# EAGLE design gecko (EAGLE 5.10)

## Sheet 1 of 3
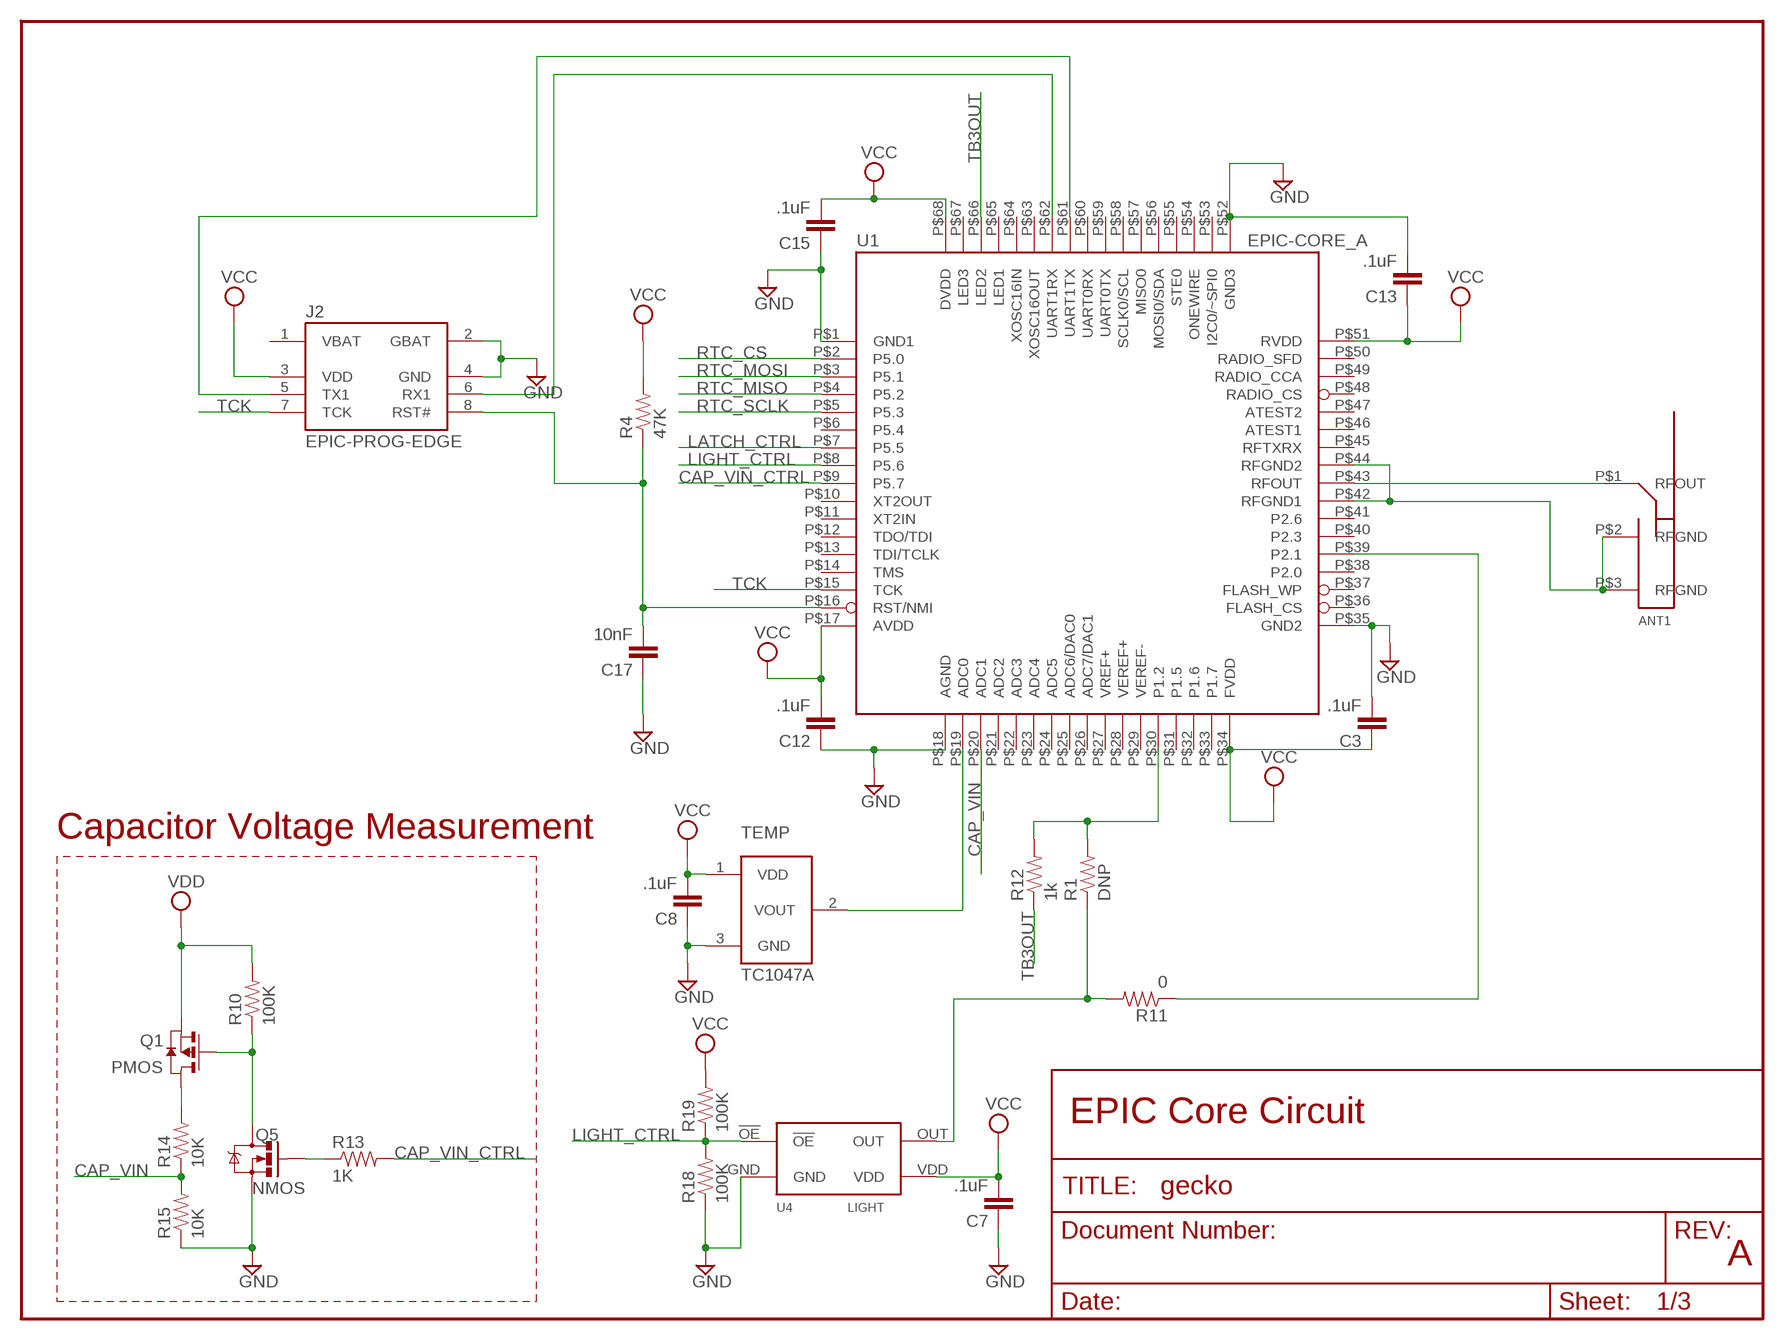
[diagram p0: schematic, sheet 1]

### Parts
ANT1  PIFA-2.4GHZ  [PIFA-2.4GHZ]
C3  .1uF  CAP0603-CAP  [0603-CAP]
C7  .1uF  CAP0603-CAP  [0603-CAP]
C8  .1uF  CAP0603-CAP  [0603-CAP]
C12  .1uF  CAP0603-CAP  [0603-CAP]
C13  .1uF  CAP0603-CAP  [0603-CAP]
C15  .1uF  CAP0603-CAP  [0603-CAP]
C17  10nF  CAP0603-CAP  [0603-CAP]
J2  EPIC-PROG-EDGE  [EPIC-PROG-EDGE]
Q1  PMOS  PMOSSOT23  [SOT-23]
Q5  NMOS  MOSFET-NCHANNELSMD  [SOT23-3]
R1  DNP  RESISTOR0603-RES  [0603-RES]
R4  47K  RESISTOR0603-RES  [0603-RES]
R10  100K  RESISTOR0603-RES  [0603-RES]
R11  0  RESISTOR0603-RES  [0603-RES]
R12  1k  RESISTOR0603-RES  [0603-RES]
R13  1K  RESISTOR0603-RES  [0603-RES]
R14  10K  RESISTOR0603-RES  [0603-RES]
R15  10K  RESISTOR0603-RES  [0603-RES]
R18  100K  RESISTOR0603-RES  [0603-RES]
R19  100K  RESISTOR0603-RES  [0603-RES]
TEMP  TC1047A  [SOT-23-3]
U1  EPIC-CORE_A  [EPIC-LCC68]
U4  LIGHT  TSL237T  [T_4LEAD]

### Nets
CAP_VIN: R14.1 R15.2 U1.P$20(ADC1)
CAP_VIN_CTRL: R13.2 U1.P$9(P5.7)
GND: C3.2 C7.1 C8.1 C12.1 C13.2 C15.1 C17.1 J2.2(GBAT) J2.4(GND) Q5.2(S) R15.1 R18.1 TEMP.3(GND) U1.P$1(GND1) U1.P$18(AGND) U1.P$35(GND2) U1.P$52(GND3) U4.GND ; also sheet 2,3
LATCH_CTRL: U1.P$7(P5.5) ; also sheet 2
LIGHT_CTRL: R18.2 R19.1 U1.P$8(P5.6) U4.!OE
LIGHT_FREQ_IN: R1.1 R11.2 U4.OUT
N$1: ANT1.P$1(RFOUT) U1.P$43(RFOUT)
N$6: Q1.3(G) Q5.3(D) R10.1
N$7: J2.6(RX1) U1.P$62(UART1RX)
N$8: R1.2 R12.2 U1.P$30(P1.2)
N$10: R11.1 U1.P$39(P2.1)
N$11: J2.5(TX1) U1.P$61(UART1TX)
N$12: Q5.1(G) R13.1
N$16: Q1.1(D) R14.2
N$17: C17.2 J2.8(RST#) R4.1 U1.P$16(RST/NMI)
N$20: TEMP.2(VOUT) U1.P$19(ADC0)
RFGND: ANT1.P$2(RFGND) ANT1.P$3(RFGND) U1.P$42(RFGND1) U1.P$44(RFGND2)
RTC_CS: U1.P$2(P5.0) ; also sheet 3
RTC_MISO: U1.P$4(P5.2) ; also sheet 3
RTC_MOSI: U1.P$3(P5.1) ; also sheet 3
RTC_SCLK: U1.P$5(P5.3) ; also sheet 3
TB3OUT: R12.1 U1.P$66(LED2)
TCK: J2.7(TCK) U1.P$15(TCK)
VCC: C3.1 C7.2 C8.2 C12.2 C13.1 C15.2 J2.3(VDD) R4.2 R19.2 TEMP.1(VDD) U1.P$17(AVDD) U1.P$34(FVDD) U1.P$51(RVDD) U1.P$68(DVDD) U4.VDD ; also sheet 2,3
VDD: Q1.2(S) R10.2 ; also sheet 2
Unconnected: J2.1(VBAT) U1.P$6(P5.4) U1.P$10(XT2OUT) U1.P$11(XT2IN) U1.P$12(TDO/TDI) U1.P$13(TDI/TCLK) U1.P$14(TMS) U1.P$21(ADC2) U1.P$22(ADC3) U1.P$23(ADC4) U1.P$24(ADC5) U1.P$25(ADC6/DAC0) U1.P$26(ADC7/DAC1) U1.P$27(VREF+) U1.P$28(VEREF+) U1.P$29(VEREF-) U1.P$31(P1.5) U1.P$32(P1.6) U1.P$33(P1.7) U1.P$36(FLASH_CS) U1.P$37(FLASH_WP) U1.P$38(P2.0) U1.P$40(P2.3) U1.P$41(P2.6) U1.P$45(RFTXRX) U1.P$46(ATEST1) U1.P$47(ATEST2) U1.P$48(RADIO_CS) U1.P$49(RADIO_CCA) U1.P$50(RADIO_SFD) U1.P$53(I2C0/~SPI0) U1.P$54(ONEWIRE) U1.P$55(STE0) U1.P$56(MOSI0/SDA) U1.P$57(MISO0) U1.P$58(SCLK0/SCL) U1.P$59(UART0TX) U1.P$60(UART0RX) U1.P$63(XOSC16OUT) U1.P$64(XOSC16IN) U1.P$65(LED1) U1.P$67(LED3)

### Notes on the sheet
- Capacitor Voltage Measurement
- EPIC Core Circuit
- A

## Sheet 2 of 3
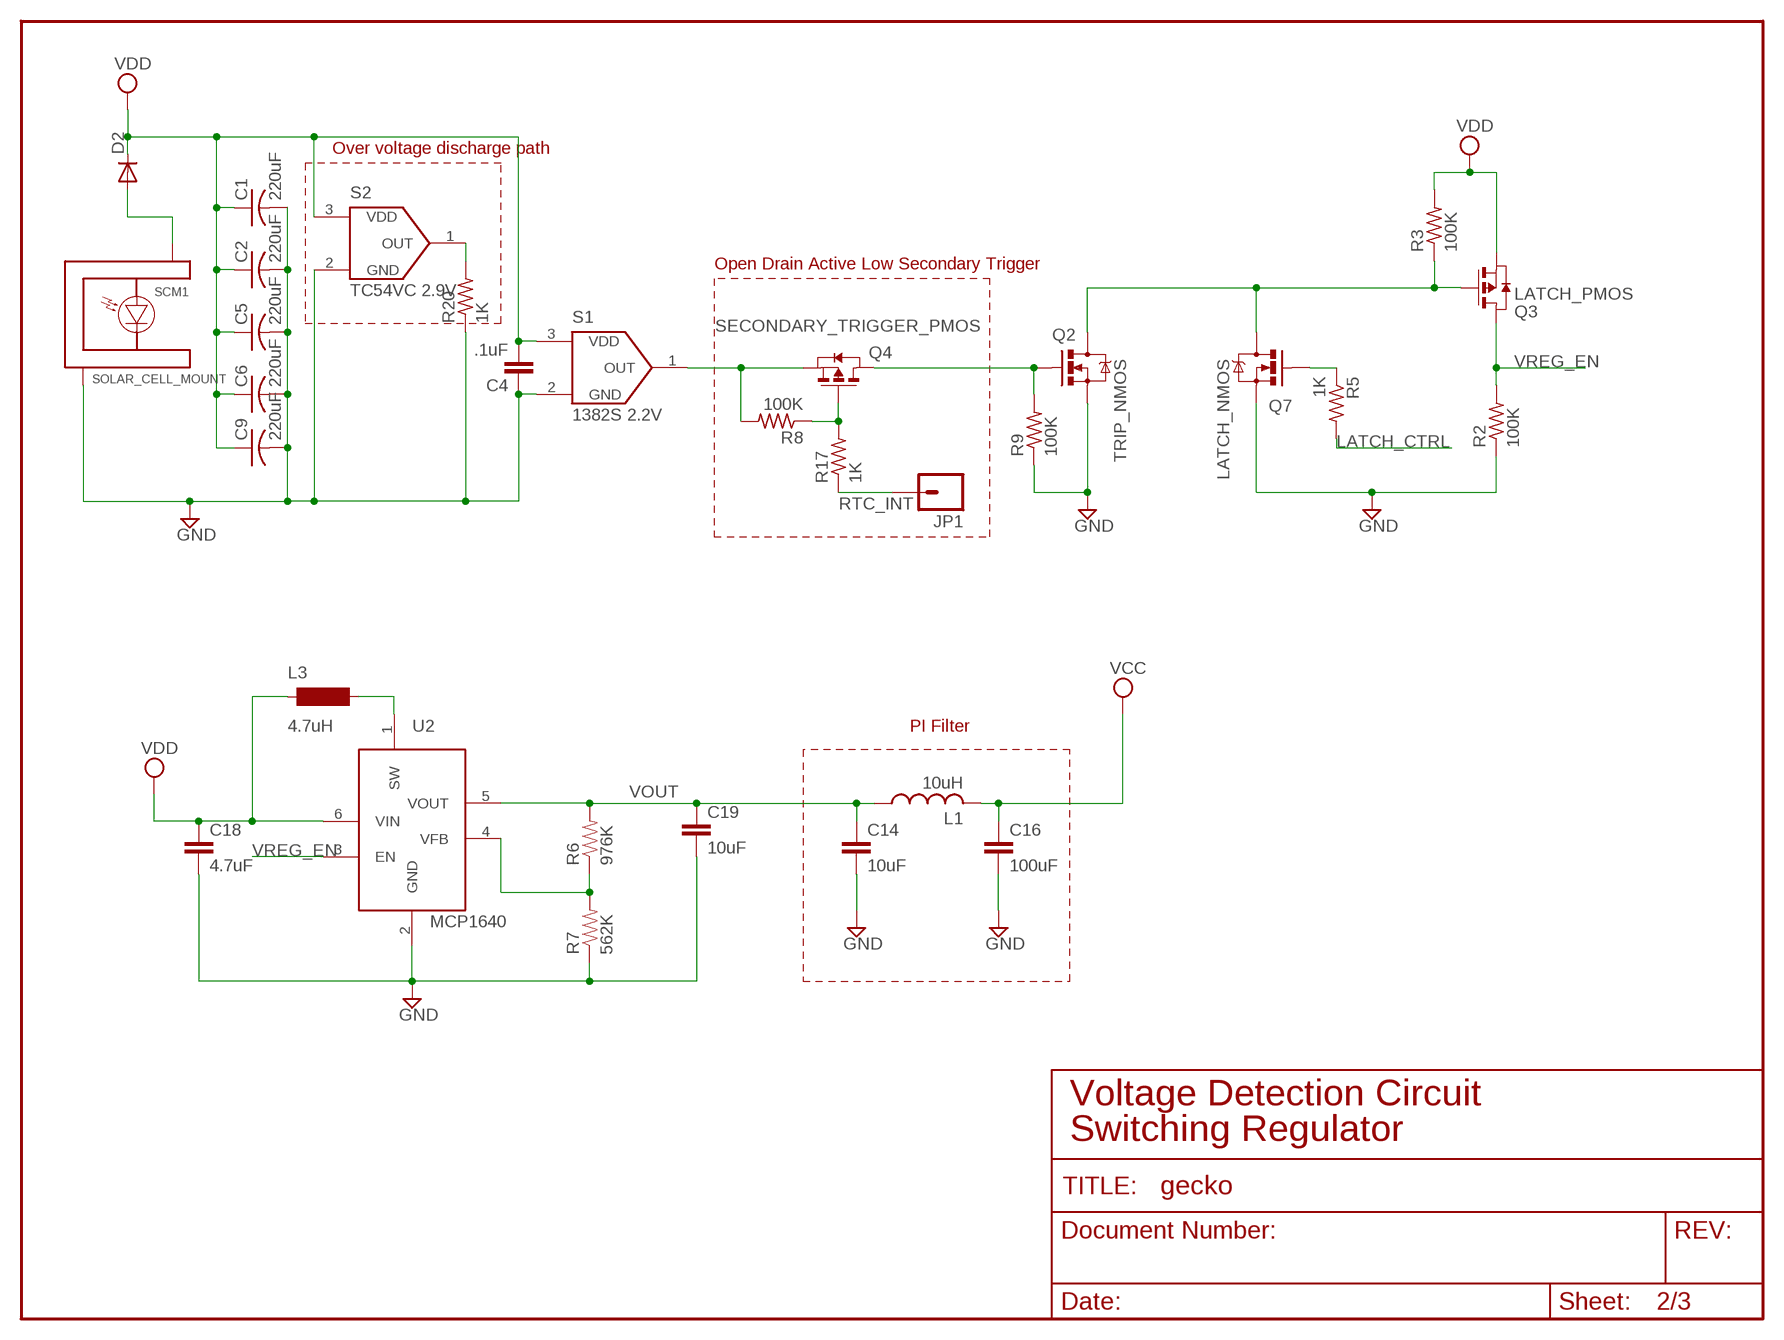
[diagram p1: schematic, sheet 2]

### Parts
C1  220uF  C-USC1206  [C1206]
C2  220uF  C-USC1206  [C1206]
C4  .1uF  CAP0603-CAP  [0603-CAP]
C5  220uF  C-USC1206  [C1206]
C6  220uF  C-USC1206  [C1206]
C9  220uF  C-USC1206  [C1206]
C14  10uF  CAP0805  [0805]
C16  100uF  CAP0805  [0805]
C18  4.7uF  CAP0603-CAP  [0603-CAP]
C19  10uF  CAP0805  [0805]
D2  DIODESOD  [SOD-323]
JP1  M01SMDNS  [1X01NS]
L1  10uH  L-USL2012C  [L2012C]
L3  4.7uH  INDUCTOR  [INDUCTOR]
Q2  TRIP_NMOS  MOSFET-NCHANNELSMD  [SOT23-3]
Q3  LATCH_PMOS  PMOSSOT23  [SOT-23]
Q4  SECONDARY_TRIGGER_PMOS  PMOSSOT23  [SOT-23]
Q7  LATCH_NMOS  MOSFET-NCHANNELSMD  [SOT23-3]
R2  100K  R-US_R0603  [R0603]
R3  100K  R-US_R0603  [R0603]
R5  1K  R-US_R0603  [R0603]
R6  976K  RESISTOR0603-RES  [0603-RES]
R7  562K  RESISTOR0603-RES  [0603-RES]
R8  100K  R-US_R0603  [R0603]
R9  100K  R-US_R0603  [R0603]
R17  1K  R-US_R0603  [R0603]
R20  1K  R-US_R0603  [R0603]
S1  1382S 2.2V  1382  [SOT-23-3]
S2  TC54VC 2.9V  1382  [SOT-23-3]
SCM1  SOLAR_CELL_MOUNT  [SOLAR_CELL_MOUNT]
U2  MCP1640  [SOT-23-6]

### Nets
GND: C1.2 C2.2 C4.1 C5.2 C6.2 C9.2 C14.2 C16.2 C18.2 C19.2 Q2.2(S) Q7.2(S) R2.1 R7.1 R9.1 R20.1 S1.2(GND) S2.2(GND) SCM1.NEG U2.2(GND) ; also sheet 1,3
LATCH_CTRL: R5.2 ; also sheet 1
N$2: Q2.1(G) Q4.1(D) R9.2
N$3: L3.2 U2.1(SW)
N$4: Q4.2(S) R8.2 S1.1(OUT)
N$5: R6.1 R7.2 U2.4(VFB)
N$9: Q2.3(D) Q3.3(G) Q7.3(D) R3.1
N$14: D2.2(A) SCM1.POS
N$15: Q7.1(G) R5.1
N$18: Q4.3(G) R8.1 R17.2
N$19: R20.2 S2.1(OUT)
RTC_INT: JP1.1 R17.1 ; also sheet 3
VCC: C16.1 L1.2 ; also sheet 1,3
VDD: C1.1 C2.1 C4.2 C5.1 C6.1 C9.1 C18.1 D2.1(C) L3.1 Q3.2(S) R3.2 S1.3(VDD) S2.3(VDD) U2.6(VIN) ; also sheet 1
VOUT: C14.1 C19.1 L1.1 R6.2 U2.5(VOUT)
VREG_EN: Q3.1(D) R2.2 U2.3(EN)

### Notes on the sheet
- Over voltage discharge path
- Open Drain Active Low Secondary Trigger
- PI Filter
- Voltage Detection Circuit
- Switching Regulator

## Sheet 3 of 3
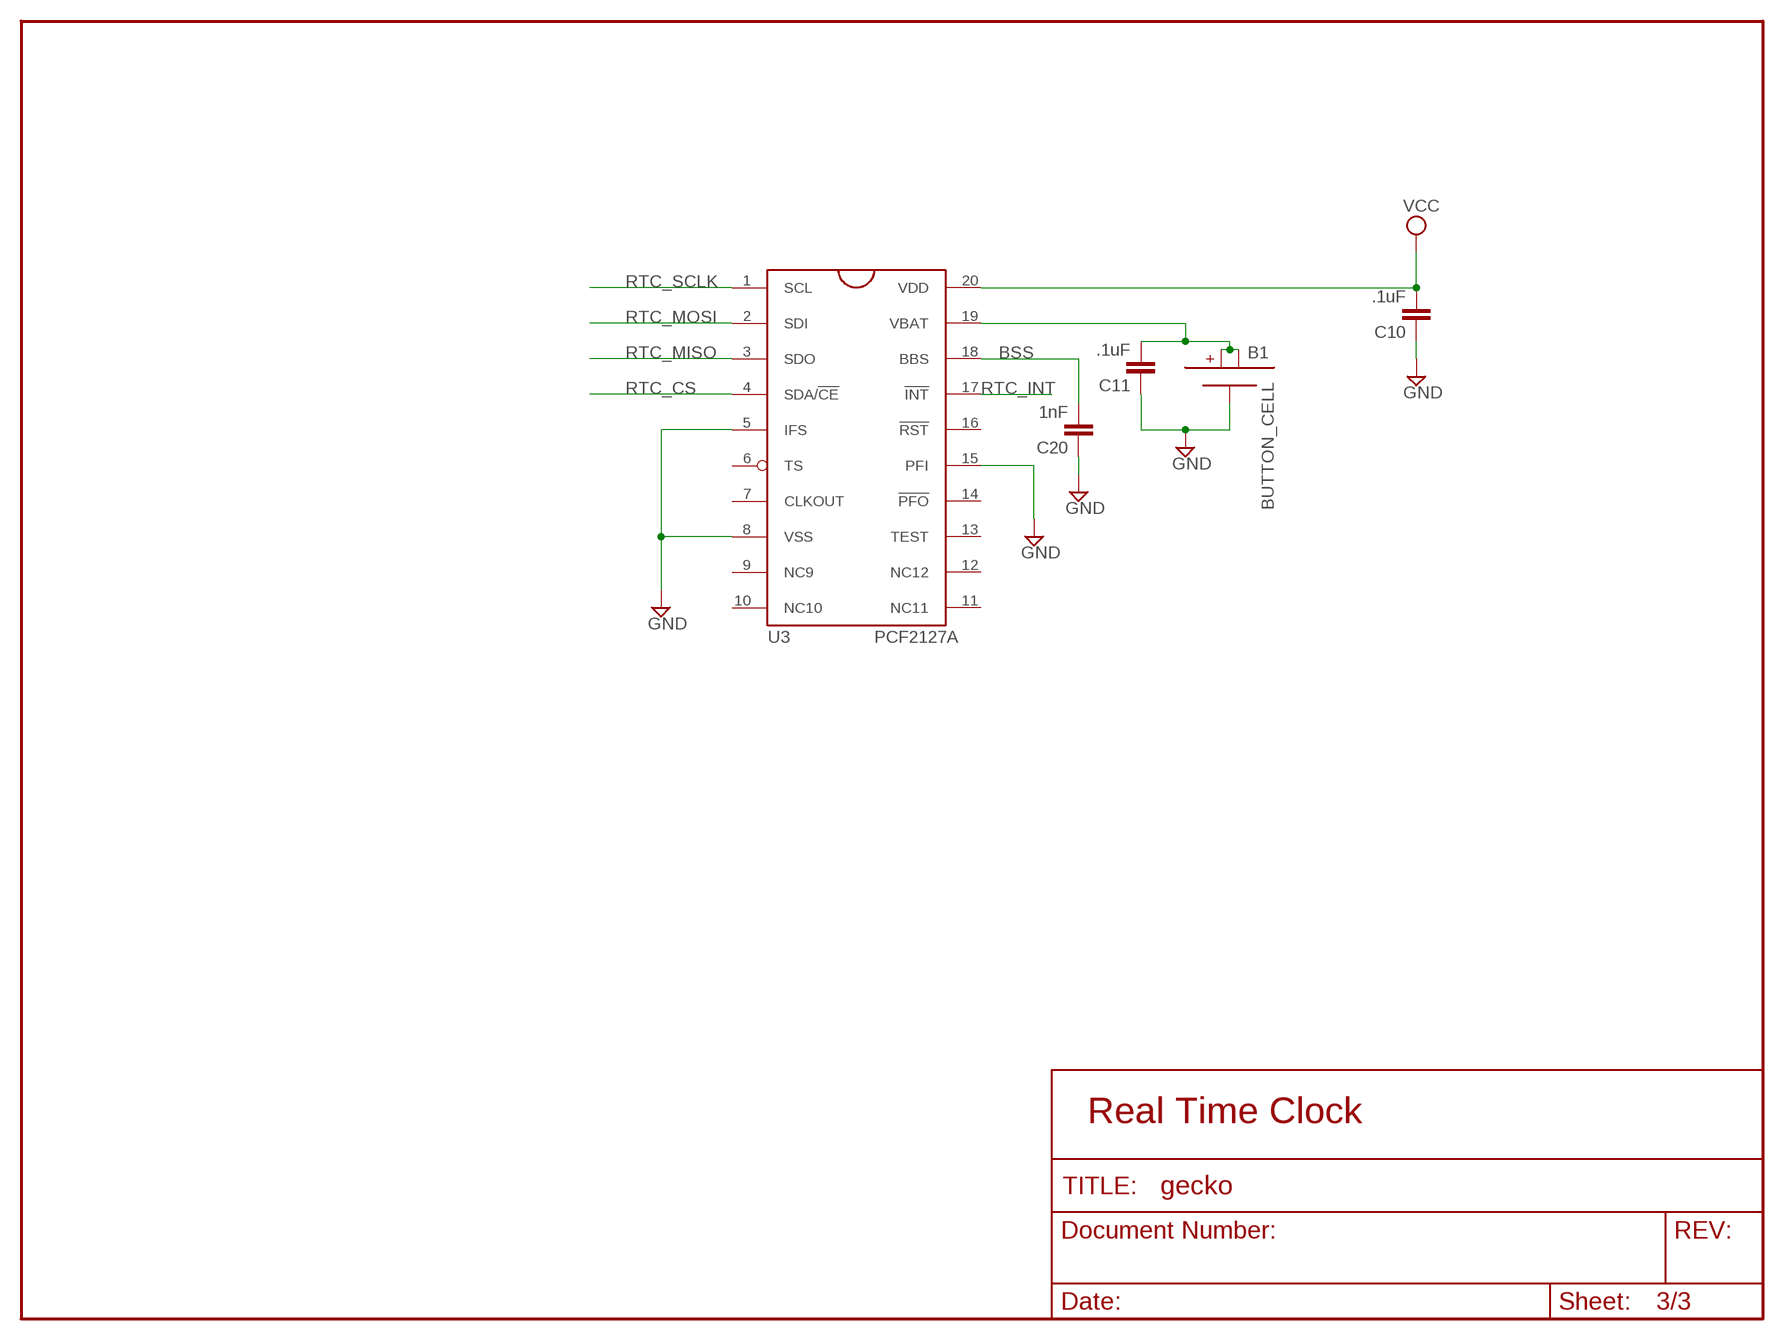
[diagram p2: schematic, sheet 3]

### Parts
B1  BUTTON_CELL  [RETAINER_3000]
C10  .1uF  CAP0603-CAP  [0603-CAP]
C11  .1uF  CAP0603-CAP  [0603-CAP]
C20  1nF  CAP0603-CAP  [0603-CAP]
U3  PCF2127A  [SO-20]

### Nets
BSS: C20.2 U3.18(BBS)
GND: B1.NEG C10.1 C11.1 C20.1 U3.5(IFS) U3.8(VSS) U3.15(PFI) ; also sheet 1,2
N$13: B1.POS1 B1.POS2 C11.2 U3.19(VBAT)
RTC_CS: U3.4(SDA/!CE) ; also sheet 1
RTC_INT: U3.17(!INT) ; also sheet 2
RTC_MISO: U3.3(SDO) ; also sheet 1
RTC_MOSI: U3.2(SDI) ; also sheet 1
RTC_SCLK: U3.1(SCL) ; also sheet 1
VCC: C10.2 U3.20(VDD) ; also sheet 1,2
Unconnected: U3.6(TS) U3.7(CLKOUT) U3.9(NC9) U3.10(NC10) U3.11(NC11) U3.12(NC12) U3.13(TEST) U3.14(!PFO) U3.16(!RST)

### Notes on the sheet
- Real Time Clock

## Library data of the parts
ANT1 = berkeley-epic:PIFA-2.4GHZ
B1 = mylibrary:BUTTON_CELL
C1 C2 C5 C6 C9 = rcl:C-US: CAPACITOR, American symbol
C3 C4 C7 C8 C10-C20 = SparkFun:CAP: Capacitor Standard 0603 ceramic capacitor, and 0.1" leaded capacitor.
D2 = SparkFun:DIODE: Diode These are standard reverse protection diodes and small signal diodes. SMA package can handle up to about 1A. SOD-323 can handle about 200mA. What the SOD-323 package when ordering, there are some mfgs out there that are 5-pin packages.
J2 = berkeley-epic:EPIC-PROG-EDGE
JP1 = SparkFun:M01: Header 1 Standard 1-pin 0.1" header. Use with straight break away headers (SKU : PRT-00116), right angle break away headers (PRT-00553), swiss pins (PRT-00743), machine pins (PRT-00117), and female headers (PRT-00115).
L1 = rcl:L-US: INDUCTOR, American symbol
L3 = mylibrary:INDUCTOR
Q1 Q3 Q4 = berkeley-epic:PMOSSOT23: MOS FET
Q2 Q5 Q7 = SparkFun:MOSFET-NCHANNEL
R1 R4 R6 R7 R10-R15 R18 R19 = SparkFun:RESISTOR: Resistor Basic schematic elements and footprints for 0603, 1206, and PTH 1/10th watt (small) resistors.
R2 R3 R5 R8 R9 R17 R20 = rcl:R-US_: RESISTOR, American symbol
S1 S2 = mylibrary:1382
SCM1 = mylibrary:SOLAR_CELL_MOUNT
TEMP = mylibrary:TC1047A
U1 = berkeley-epic:EPIC-CORE_A
U2 = mylibrary:MCP1640
U3 = mylibrary:PCF2127A
U4 = mylibrary:TSL237T

## Board
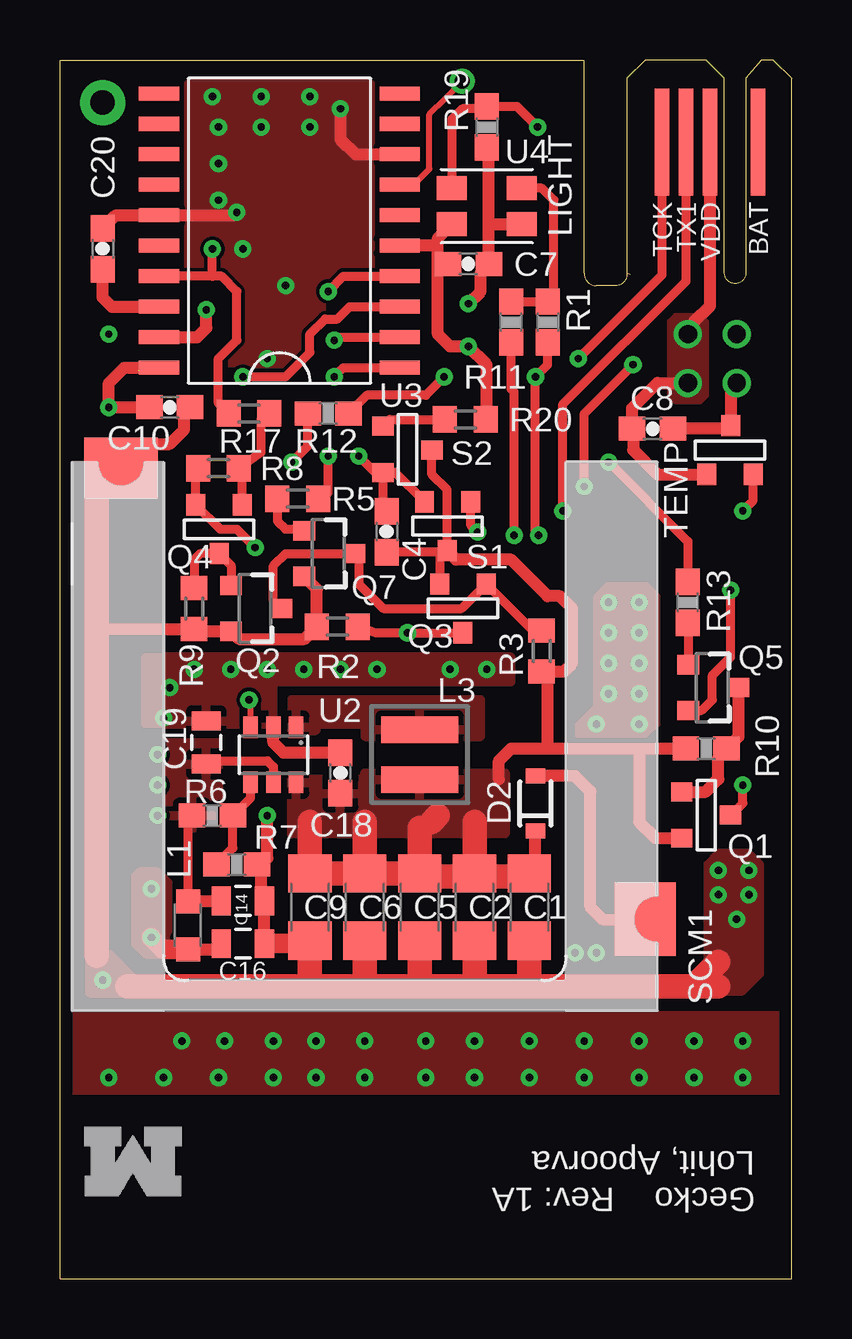
[diagram p3: board, top side]
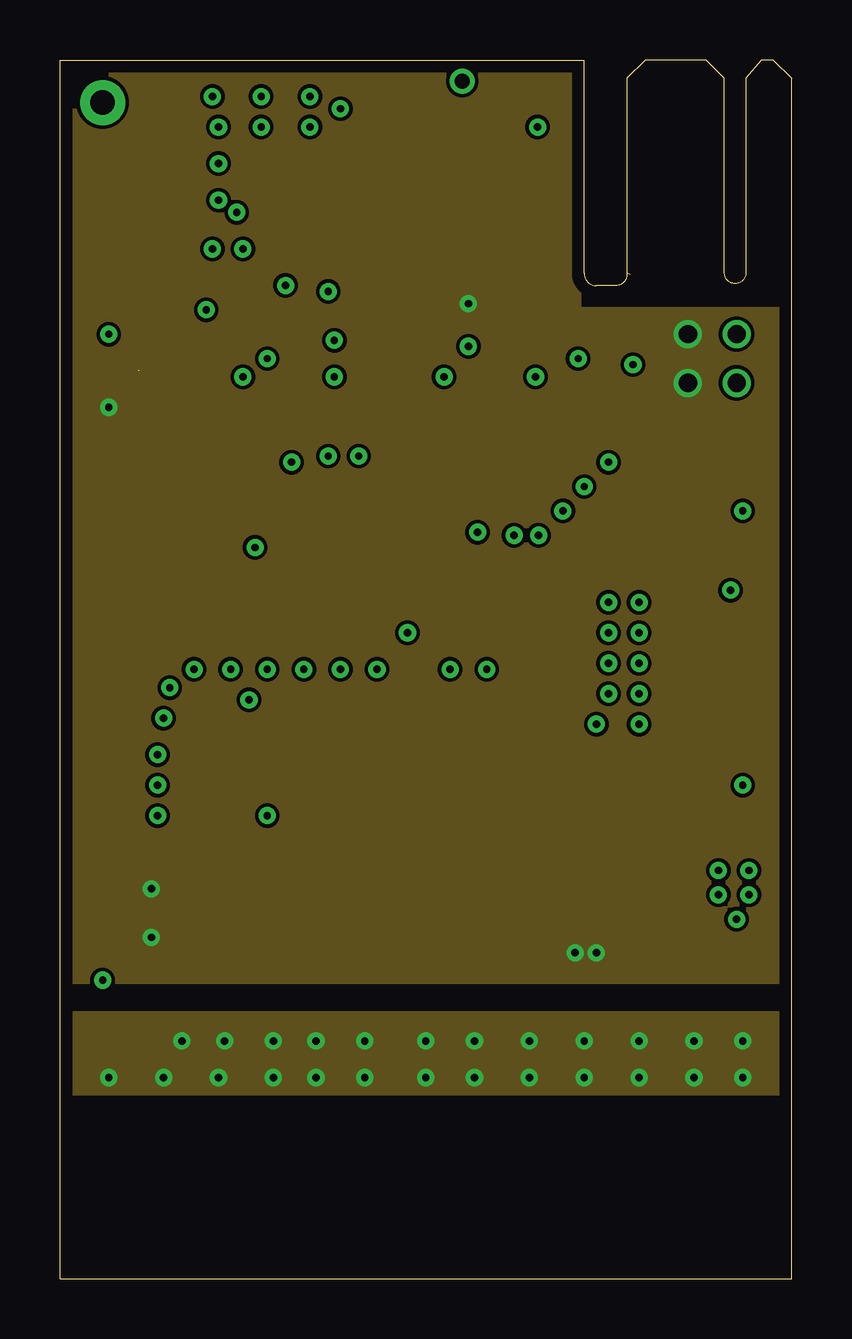
[diagram p4: board, inner layer Power]
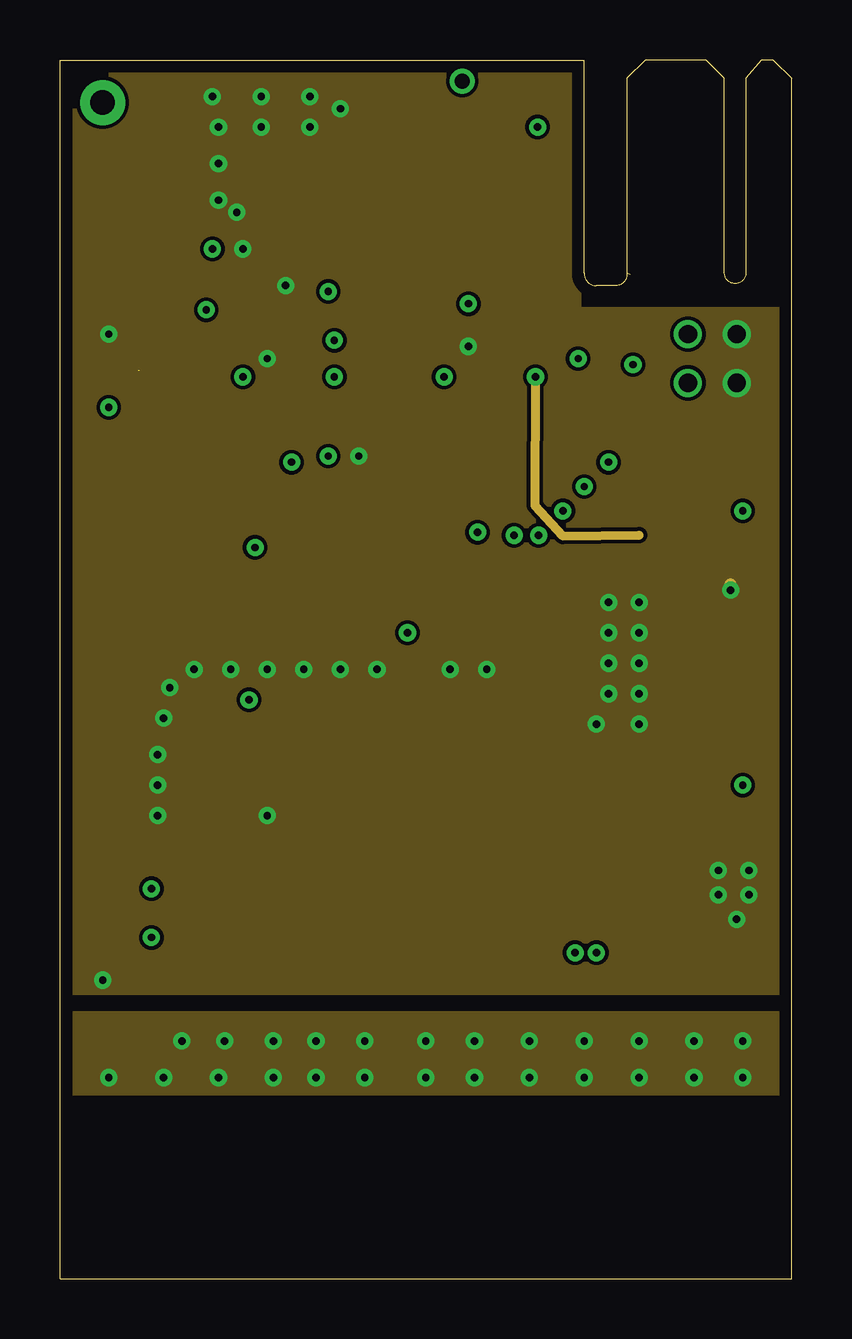
[diagram p5: board, inner layer Ground]
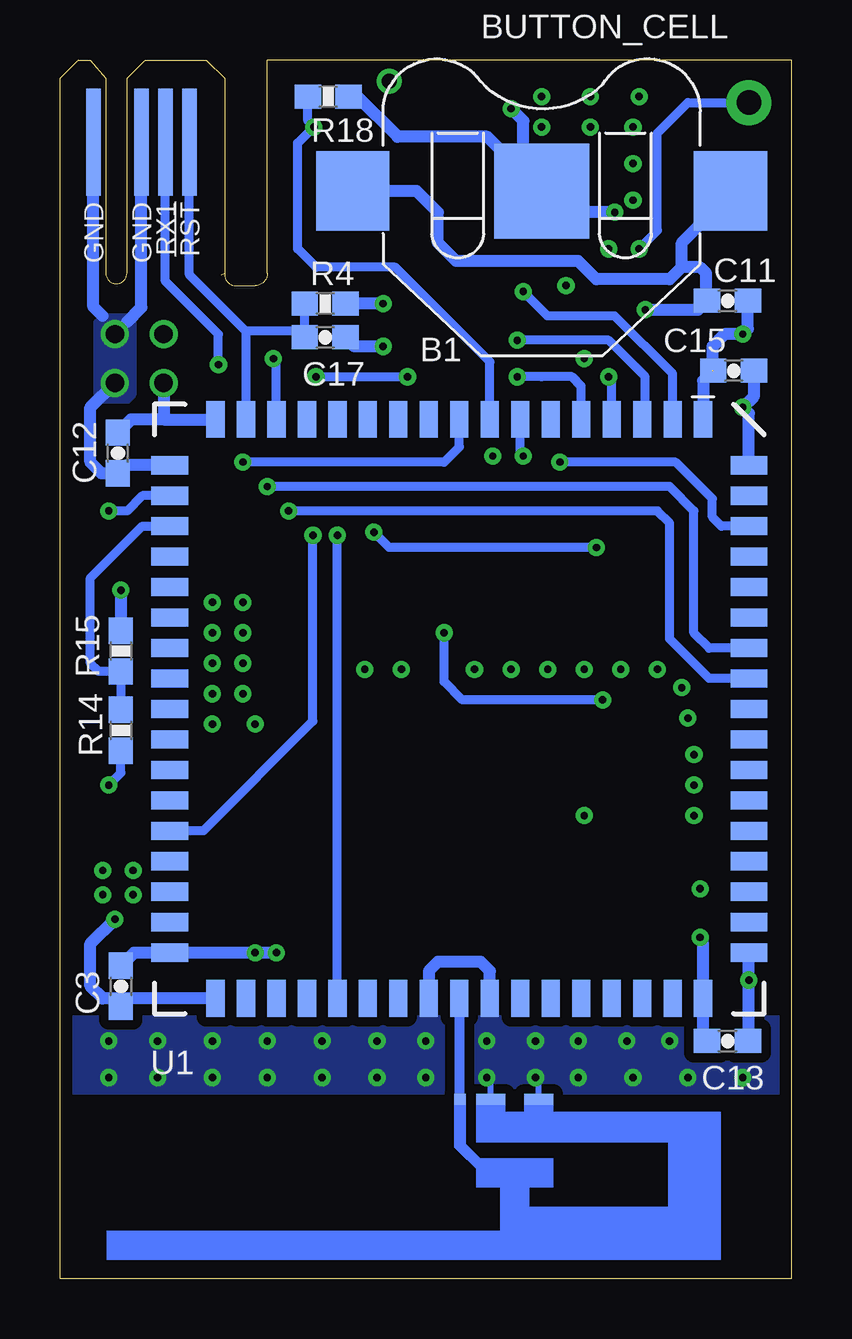
[diagram p6: board, bottom side, seen from below]

Size 30.48 x 50.8 mm. Coordinates in mm from the lower left corner, seen from the top.
Outline: 23.62,41.91 23.62,50.04 24.38,50.8 26.92,50.8 27.69,50.04 27.69,41.91 arc177 28.57,41.91 28.57,50.04 29.21,50.8 29.72,50.8 30.48,50.04 30.48,0 0,0 0,50.8 21.84,50.8 21.84,41.91 arc93 22.35,41.39 23.18,41.39 arc90 23.62,41.91
Outline: 23.76,41.85 23.62,41.91
Copper layers (1+2*15+16): Top 0.0178mm / dielectric 0.3048mm / Power 0.0356mm / dielectric 0.7112mm / Ground 0.0356mm / dielectric 0.3048mm / Bottom 0.0178mm
Design rules "SSC-EAGLE-4Lyr_v1.0.0.3 *": minimum track width 6mil, minimum drill 8mil, track to track 6mil, track to pad 6mil, pad to pad 6mil, via to via 6mil, smd to smd 6mil, copper to edge 20mil, drill to drill 16mil, minimum pad ring 8mil, minimum via ring 8mil, stop-mask expansion 3mil, vias tented up to drill 12mil, thermal gap 10mil

### Footprints (pad centres in the part's own frame; a part is rotated, then mirrored left to right if it is on the bottom)
PIFA-2.4GHZ = smd 0.46 x 0.46: P$1 -2.65,-1.495 | smd 0.46 x 1.2: P$2 -2.655,1.785; P$3 -2.65,-0.215
RETAINER_3000 = smd 3.962 x 3.962: NEG 0,0 | smd 3.048 x 3.302: POS1 -7.874,0; POS2 7.874,0
C1206 = smd 1.6 x 1.8: 1 -1.4,0; 2 1.4,0
0603-CAP = smd 1.1 x 1: 1 -0.85,0; 2 0.85,0
0805 = smd 0.8 x 1.2: 1 -0.9,0; 2 0.9,0
SOD-323 = smd 0.63 x 0.83: 1 -1.15,0; 2 1.15,0
EPIC-PROG-EDGE = smd 0.61 x 4.445: 1 -1.001,3.619; 3 1.001,3.619; 5 2.002,3.619; 7 3.002,3.619 | smd 0.61 x 4.445 bottom: 2 -1.001,3.619; 4 1.001,3.619; 6 2.002,3.619; 8 3.002,3.619
1X01NS = drill 1.016 pad 1.88 round: 1 0,0
L2012C = smd 1 x 1: 1 -1,0; 2 1,0
INDUCTOR = smd 1.118 x 3.2: 1 -1.041,0; 2 1.041,0
SOT-23 = smd 0.787 x 0.889: 1 0.025,-1.016; 2 -0.94,1.016; 3 0.991,1.016
SOT23-3 = smd 0.8 x 0.9: 1 -0.95,-1; 2 0.95,-1; 3 0,1.1
0603-RES = smd 1.1 x 1: 1 -0.85,0; 2 0.85,0
R0603 = smd 1 x 1.1: 1 -0.85,0; 2 0.85,0
SOT-23-3 = smd 0.787 x 0.889: 1 -0.991,-1.016; 2 0.94,-1.016; 3 0,1.016
SOLAR_CELL_MOUNT = smd 2.54 x 3.048: NEG 22.606,22.352 | smd 3.048 x 2.54: POS 3.81,0.508
EPIC-LCC68 = smd 1.524 x 0.762: P$1 -12.065,10.16; P$2 -12.065,8.89; P$3 -12.065,7.62; P$4 -12.065,6.35; P$5 -12.065,5.08; P$6 -12.065,3.81; P$7 -12.065,2.54; P$8 -12.065,1.27; P$9 -12.065,0; P$10 -12.065,-1.27; P$11 -12.065,-2.54; P$12 -12.065,-3.81; P$13 -12.065,-5.08; P$14 -12.065,-6.35; P$15 -12.065,-7.62; P$16 -12.065,-8.89; P$17 -12.065,-10.16; P$35 12.065,-10.16; P$36 12.065,-8.89; P$37 12.065,-7.62; P$38 12.065,-6.35; P$39 12.065,-5.08; P$40 12.065,-3.81; P$41 12.065,-2.54; P$42 12.065,-1.27; P$43 12.065,0; P$44 12.065,1.27; P$45 12.065,2.54; P$46 12.065,3.81; P$47 12.065,5.08; P$48 12.065,6.35; P$49 12.065,7.62; P$50 12.065,8.89; P$51 12.065,10.16 | smd 0.762 x 1.524: P$18 -10.16,-12.065; P$19 -8.89,-12.065; P$20 -7.62,-12.065; P$21 -6.35,-12.065; P$22 -5.08,-12.065; P$23 -3.81,-12.065; P$24 -2.54,-12.065; P$25 -1.27,-12.065; P$26 0,-12.065; P$27 1.27,-12.065; P$28 2.54,-12.065; P$29 3.81,-12.065; P$30 5.08,-12.065; P$31 6.35,-12.065; P$32 7.62,-12.065; P$33 8.89,-12.065; P$34 10.16,-12.065; P$52 10.16,12.065; P$53 8.89,12.065; P$54 7.62,12.065; P$55 6.35,12.065; P$56 5.08,12.065; P$57 3.81,12.065; P$58 2.54,12.065; P$59 1.27,12.065; P$60 0,12.065; P$61 -1.27,12.065; P$62 -2.54,12.065; P$63 -3.81,12.065; P$64 -5.08,12.065; P$65 -6.35,12.065; P$66 -7.62,12.065; P$67 -8.89,12.065; P$68 -10.16,12.065
SOT-23-6 = smd 0.6 x 0.9: 1 -0.95,-1.15; 2 0,-1.15; 3 0.95,-1.15; 4 0.95,1.15; 5 0,1.15; 6 -0.95,1.15
SO-20 = smd 1.676 x 0.584: 1 -5.016,5.715; 2 -5.016,4.445; 3 -5.016,3.175; 4 -5.016,1.905; 5 -5.016,0.635; 6 -5.016,-0.635; 7 -5.016,-1.905; 8 -5.016,-3.175; 9 -5.016,-4.445; 10 -5.016,-5.715; 11 5.016,-5.715; 12 5.016,-4.445; 13 5.016,-3.175; 14 5.016,-1.905; 15 5.016,-0.635; 16 5.016,0.635; 17 5.017,1.905; 18 5.016,3.175; 19 5.016,4.445; 20 5.016,5.715
T_4LEAD = smd 1.25 x 1: !OE -1.45,0.75; GND -1.45,-0.75; OUT 1.45,0.75; VDD 1.45,-0.75

### Placement (x,y rotation side)
ANT1  12.32,4.83 270 bottom
B1  10.41,45.34 0 bottom
C1  19.56,15.49 270 top
C2  17.27,15.49 270 top
C3  27.94,12.19 270 bottom
C4  13.61,31.14 270 top
C5  14.99,15.49 270 top
C6  12.7,15.49 270 top
C7  17.02,42.29 0 top
C8  24.69,35.43 180 top
C9  10.41,15.49 270 top
C10  4.57,36.32 180 top
C11  2.67,40.77 180 bottom
C12  28.07,34.42 90 bottom
C13  2.67,9.91 0 bottom
C14  7.62,15.75 0 top
C15  2.41,37.85 0 bottom
C16  7.62,13.97 0 top
C17  19.43,39.24 180 bottom
C18  11.68,21.08 90 top
C19  6.1,22.35 90 top
C20  1.78,42.93 270 top
D2  19.81,19.81 90 top
J2  28.09,51 180 top
JP1  1.78,49.02 0 top
L1  5.33,14.73 270 top
L3  14.99,21.84 90 top
Q1  26.92,19.3 90 top
Q2  8.13,27.94 270 top
Q3  16.76,27.94 0 top
Q4  6.6,31.24 0 top
Q5  27.18,24.64 270 top
Q7  11.18,30.23 270 top
R1  20.32,39.88 270 top
R2  11.56,27.18 0 top
R3  20.07,26.16 270 top
R4  19.43,40.64 0 bottom
R5  9.91,32.51 0 top
R6  6.35,19.3 180 top
R7  7.37,17.27 180 top
R8  6.6,33.78 180 top
R9  5.59,27.94 90 top
R10  26.92,22.1 180 top
R11  18.8,39.88 90 top
R12  11.18,36.07 0 top
R13  26.16,28.19 90 top
R14  27.94,22.86 270 bottom
R15  27.94,26.16 270 bottom
R17  7.87,36.07 0 top
R18  19.3,49.28 180 bottom
R19  17.78,48.01 270 top
R20  16.89,35.81 180 top
S1  16.13,31.37 180 top
S2  14.48,34.54 270 top
SCM1  24.89,11.18 90 top
TEMP  27.94,34.54 0 top
U1  13.84,23.75 270 bottom
U2  8.89,21.84 180 top
U3  9.14,43.69 180 top
U4  17.78,44.7 0 top
U$1  [BLOCK-M]  5.08,6.35 180 top

### Tracks (layer width: path | path; a pad name or v marks a point on that pad's centre or on a via)
BSS
  Top 0.508: U3.18 2.16,40.51 1.78,40.89 C20.2
CAP_VIN
  Bottom 0.381: R14.1 R15.2 28.87,25.31 29.21,25.65 29.21,29.21 27.05,31.37 U1.P$20
CAP_VIN_CTRL  (via drill 0.3)
  Top 0.381: R13.2 26.16,30.73 v22.86,34.04
  Bottom 0.381: v22.86,34.04 14.48,34.04 13.84,34.67 U1.P$9
GND  (via drill 0.3, 0.76)  (1 unrouted)
  Top 0.305: R20.1 17.78,36.16
  Top 0.381: C14.2 8.38,16.12 | 8.38,17.53 R7.1 | Q5.2 26.74,23.69 27.18,24.13 27.18,25.15 27.94,25.91 v27.94,28.7 | R2.1 11.03,26.99 | S2.2 13.97,33.6 S1.2 | S2.2 13.13,33.6 v12.45,34.29 | C4.1 13.46,31.99 S2.2
  Top 0.508: U2.2 8.89,22.35 9.31,21.93 C18.2 11.6,22.1 | 8.38,16.12 8.38,17.27 | 8.38,17.27 8.38,17.53 | C16.2 C14.2 | C8.1 27.81,35.43 TEMP.3 27.94,37.08 v28.19,37.34 | 17.78,35.81 17.78,36.16 17.78,38.1 v17.02,38.86 16.26,38.86 15.75,39.37 15.75,42.42 | 1.52,27.18 1.61,27.09 R9.1 5.69,26.99 Q2.2 7.45,26.67 10.2,26.67 R2.1 10.71,28.75 Q7.2 | 15.75,42.42 15.75,43.18 | 15.75,43.18 15.75,43.37 U4.GND | U3.5 15.62,43.05 15.75,43.18 | C7.1 15.88,42.29 15.75,42.42 | U3.8 12.32,46.86 11.68,47.5 v11.68,48.77 | v7.37,44.45 7.24,44.32 U3.15 2.33,44.32 C20.1 | v8.64,19.3 8.64,17.53 8.38,17.27 | C10.1 5.33,36.32 5.17,36.16 5.17,35.39 4.57,34.8 3.56,34.8 SCM1.NEG
  Top 0.813: C16.2 10.29,13.97 C9.2
  Top 1.016: SCM1.NEG 1.52,32.77 1.52,27.18 1.52,13.46 | 2.79,12.19 10.41,12.19 | 10.41,12.19 12.7,12.19 | 12.7,12.19 14.99,12.19 | 14.99,12.19 17.02,12.19 | 17.02,12.19 19.56,12.19 | 19.56,12.19 26.42,12.19 | 10.41,12.19 C9.2 | 12.7,12.19 C6.2 | 14.99,12.19 C5.2 | C2.2 17.27,12.45 17.02,12.19 | 19.56,12.19 C1.2 | 26.42,12.19 27.43,13.21 | 26.42,12.19 27.43,12.19
  Ground 0.508: v27.94,28.7 27.94,28.96
  Bottom 0.508: U1.P$52 v1.78,12.45 1.78,9.95 C13.2 | U1.P$35 27.6,11.68 | 27.6,11.68 C3.2 | 27.6,11.68 28.7,11.68 29.21,12.19 29.21,13.97 v28.19,14.99 | v27.94,28.7 R15.1 | J2.2 29.09,40.52 28.7,40.13 | J2.4 27.09,40.48 27.69,39.88 | U1.P$18 27.73,33.91 C12.1 28.74,33.57 29.21,34.04 29.21,36.32 v28.19,37.34 | U1.P$1 3.68,37.43 C15.1 | v17.02,38.86 18.2,38.86 C17.1 | B1.NEG 11.62,46.55 | v11.68,48.77 11.18,48.26 11.18,46.99 11.62,46.55 | v7.37,44.45 9.4,44.45 | C11.1 1.82,39.59 v2.03,39.37 2.79,39.37 3.3,38.86 3.3,37.85 | R18.1 18.09,49.28 16.41,47.6 12.68,47.6 11.62,46.55
  other vias: 27.43,17.02 4.57,24.64 28.19,39.37 22.86,24.38 17.78,25.4 28.7,17.02 27.43,16 28.7,16 16.26,25.4 13.21,25.4 11.68,25.4 10.16,25.4 8.64,25.4 7.11,25.4 5.59,25.4 4.32,23.37 4.06,21.84 4.06,20.57 4.06,19.3 22.35,23.11 24.13,23.11 24.13,24.38 24.13,25.65 24.13,26.92 24.13,28.19 22.86,28.19 22.86,26.92 22.86,25.65 6.35,49.28 8.38,49.28 10.41,49.28 10.41,48.01 8.38,48.01 6.6,48.01 6.6,46.48 6.6,44.96 7.62,42.93 9.4,41.4 8.64,38.35
  pour Top: 18.8,24.89 18.8,25.91 3.56,25.91 3.56,23.11 8.89,23.11 8.89,24.89
  pour Ground: 0.25,50.55 21.59,50.55 21.59,40.39 30.23,40.39 30.23,11.94 0.25,11.94
  pour Top: 1.27,12.95 1.27,11.94 3.05,11.94 3.05,12.45 2.03,13.46 1.27,13.46
  pour Top: 26.92,17.27 26.92,11.94 28.45,11.94 29.21,12.7 29.21,17.27 28.7,17.78 27.43,17.78
  pour Bottom: 27.69,40.13 27.43,39.88 27.43,36.83 27.69,36.58 28.7,36.58 28.96,36.83 28.96,39.88 28.7,40.13
  pour Top: 22.86,28.96 24.38,28.96 24.89,28.45 24.89,23.11 23.88,22.1 23.88,19.3 23.62,19.05 22.61,19.05 22.35,19.3 22.35,21.84 21.59,22.61 21.59,23.11 22.35,23.88 22.35,28.45
  pour Top: 5.33,49.78 5.33,38.1 12.95,38.1 12.95,49.78
LATCH_CTRL  (via drill 0.3)
  Top 0.381: v11.18,34.29 11.18,32.77 R5.2
  Bottom 0.381: U1.P$7 11.3,34.42 v11.18,34.29
LIGHT_CTRL  (via drill 0.3)
  Top 0.381: v19.9,48.01 19.05,48.86 R19.1 17.69,48.77 16.76,48.77 16.33,48.33 U4.!OE
  Bottom 0.381: R18.2 20.15,48.26 v19.9,48.01 20.57,47.33 20.57,42.93 19.81,42.16 16.51,42.16 12.57,38.23 U1.P$8
LIGHT_FREQ_IN
  Top 0.381: R11.2 R1.1 20.57,40.98 20.57,44.96 20.08,45.45 U4.OUT
N$1
  Bottom 0.409: ANT1.P$1 13.81,11.65
  Bottom 0.508: 13.81,11.65 U1.P$43
N$2
  Top 0.381: R9.2 5.59,29.97 5.84,30.23 Q4.1 7.13,29.73 Q2.1
N$3
  pour Top: 10.67,22.86 10.67,23.11 12.7,23.11 12.7,22.61 17.53,22.61 17.53,24.13 9.65,24.13 9.65,22.86
N$4  (via drill 0.3)
  Top 0.381: R8.2 5.66,33.69 Q4.2 6.68,31.24 7.37,31.24 v8.13,30.48 | v17.4,31.11 17.12,31.39 S1.1
  Bottom 0.381: v17.4,31.11 16.76,30.48 v8.13,30.48
N$5
  Top 0.381: U2.4 7.94,20.04 R6.1 7.2,17.96 R7.2
N$6
  Top 0.508: Q1.3 26.9,20.3 27.43,20.83 27.43,21.76 R10.1 | R10.1 27.69,22.01 | Q5.3 28.28,22.6 R10.1
N$7  (via drill 0.3)
  Top 0.381: v21.84,33.02 21.84,36.07 v23.88,38.1
  Bottom 0.381: U1.P$62 3.43,26.29 4.06,26.92 4.06,32 5.08,33.02 v21.84,33.02 | J2.6 26.09,41.58 23.88,39.37 v23.88,38.1
N$8  (via drill 0.3)
  Top 0.381: R1.2 20.32,38.1 v19.81,37.59 19.81,31.11 v19.94,30.99 | v16,37.59 15.24,36.83 12.79,36.83 R12.2
  Ground 0.381: 24.13,30.99 20.95,30.96 19.79,32.23 v19.81,37.59
  Bottom 0.381: U1.P$30 24.51,18.67 19.94,23.24 v19.94,30.99 | v19.81,37.59 v16,37.59
N$9
  Top 0.381: Q2.3 8.89,28.28 8.89,29.72 9.4,30.23 Q7.3 12.45,30.06 12.45,28.96 13.46,27.94 16.74,27.94 Q3.3 19.7,27.01 R3.1
N$10  (via drill 0.3)
  Top 0.381: R11.1 18.8,37.08 18.92,36.96 v18.92,30.99
  Bottom 0.381: U1.P$39 v18.92,30.99
N$11  (via drill 0.3)
  Top 0.381: J2.5 26.09,41.58 20.95,36.45 v20.95,32
  Bottom 0.381: U1.P$61 3.43,25.02 5.08,26.67 5.08,31.5 5.59,32 v20.95,32
N$12
  Top 0.381: Q5.1 26.18,27.33 R13.1
N$13  (via drill 0.3)
  Top 0.508: U3.19 5.71,39.24 6.1,39.62 v6.1,40.39
  Bottom 0.508: B1.POS1 15.62,45.34 14.73,44.45 14.73,43.18 13.97,42.42 8.89,42.42 8.13,41.66 5.08,41.66 4.57,42.16 | 4.57,42.16 4.57,43.18 2.79,44.96 2.79,45.09 B1.POS2 | 4.57,42.16 3.81,42.16 3.56,41.91 3.56,40.81 C11.2 3.9,40.39 v6.1,40.39
N$14
  Top 0.508: D2.2 21.46,20.96 22.1,20.32 22.1,15.49 22.61,14.99 SCM1.POS
N$15
  Top 0.381: R5.1 9.06,31.58 9.4,31.24 10.11,31.24 Q7.1
N$16  (via drill 0.3)
  Top 0.381: Q1.1 28.22,19.58 28.45,19.81 v28.45,20.57
  Bottom 0.381: v28.45,20.57 27.94,21.08 R14.2
N$17
  Bottom 0.381: J2.8 25.09,41.85 22.73,39.5 | 22.73,39.5 U1.P$16 | C17.2 20.54,39.5 | 20.54,39.5 22.73,39.5 | 20.54,39.5 20.28,39.5 R4.1
N$18
  Top 0.381: Q4.3 7.59,33.64 R8.1 8.38,34.46 8.38,35.81 8.64,36.07 R17.2
N$19
  Top 0.254: S2.1 13.74,35.81
  Top 0.381: 13.74,35.81 R20.2
N$20  (via drill 0.3)
  Top 0.381: TEMP.2 28.88,32.44 v28.45,32
  Bottom 0.381: v28.45,32 27.69,32 27.05,32.64 U1.P$19
N$21
  Top 0.254: 14.86,45.7 14.86,45.72 15.39,46.25 15.39,48.54 16.74,49.86
N$22  (via drill 0.64)
  other vias: 16.76,49.91
RFGND  (via drill 0.3)
  Bottom 0.254: ANT1.P$3 12.53,8.22 v12.7,8.38 | ANT1.P$2 10.53,8.25 v10.67,8.38
  Bottom 0.508: U1.P$44 12.57,12.83 12.95,13.21 14.73,13.21 15.11,12.83 U1.P$42
  other vias: 6.6,8.38 5.08,9.91 6.86,9.91 8.89,9.91 17.27,9.91 19.56,9.91 21.84,9.91 24.13,9.91 26.42,9.91 28.45,9.91 28.45,8.38 26.42,8.38 24.13,8.38 21.84,8.38 19.56,8.38 17.27,8.38 15.24,8.38 4.32,8.38 2.03,8.38 8.89,8.38 15.24,9.91 12.7,9.91 10.67,9.91
  pour Bottom (isolate 0.406, no thermals): 0.25,10.92 30.23,10.92 30.2,7.75 0.23,7.75
  pour Top: 0.25,10.92 30.23,10.92 30.25,7.92 0.28,7.92
  pour Power: 0.25,10.92 30.23,10.92 30.23,7.87 0.25,7.87
  pour Ground (rank 2): 0.25,10.92 30.23,10.92 30.23,7.87 0.25,7.87
RTC_CS  (via drill 0.3)
  Top 0.381: U3.4 11.81,41.78 v11.18,41.15
  Bottom 0.381: U1.P$2 4.95,37.72 7.37,40.13 10.16,40.13 v11.18,41.15
RTC_INT  (via drill 0.3)
  Top 0.381: 6.35,41.78 6.73,41.78 7.37,41.15 7.37,39.12 6.6,38.35 6.6,36.49 R17.1 | 6.35,41.78 U3.17 | 6.35,41.78 v6.35,42.93
  Bottom 0.381: JP1.1 4.32,49.02 5.59,47.75 5.59,43.69 v6.35,42.93
RTC_MISO  (via drill 0.3)
  Top 0.381: v7.62,37.59 9.4,37.59 10.41,38.61 10.41,39.37 11.05,40.01 11.56,40.01 12.06,40.51 U3.3
  Bottom 0.381: U1.P$4 7.49,37.47 v7.62,37.59
RTC_MOSI  (via drill 0.3)
  Top 0.381: U3.2 11.56,39.24 v11.43,39.12
  Bottom 0.381: v11.43,39.12 7.62,39.12 6.1,37.59 6.1,35.94 U1.P$3
RTC_SCLK  (via drill 0.3)
  Top 0.381: U3.1 11.81,37.97 v11.43,37.59
  Bottom 0.381: U1.P$5 8.76,37.21 9.14,37.59 10.41,37.59 v11.43,37.59
TB3OUT  (via drill 0.3)
  Top 0.381: v9.65,34.04 10.33,34.71 R12.1
  Bottom 0.381: U1.P$66 2.92,31.37 3.3,31.75 3.3,32.51 4.83,34.04 v9.65,34.04
TCK  (via drill 0.3)
  Top 0.381: J2.7 25.09,41.85 v21.59,38.35
  Bottom 0.381: v21.59,38.35 21.46,38.23 U1.P$15
VCC  (via drill 0.3, 0.76)
  Top 0.508: L1.2 6.48,13.73 C16.1 | J2.3 27.09,40.55 26.42,39.88 | TEMP.1 24.89,33.53 23.88,34.54 23.88,35.4 C8.2 23.84,36.28 24.89,37.34 v26.16,37.34 | v17.02,40.64 17.53,41.15 17.53,41.91 17.65,42.04 17.65,42.29 C7.2 17.87,43.95 | 19.22,43.94 U4.VDD 17.87,43.95 | 17.87,43.95 17.87,47.07 R19.2 | C10.2 v2.03,36.32 2.03,37.34 2.67,37.97 U3.20
  Top 0.813: L1.2 4.3,13.73 v3.81,14.22
  Bottom 0.508: v3.81,14.22 3.68,13.97 U1.P$51 3.68,10.07 C13.1 | C3.1 27.39,13.59 U1.P$34 v21.46,13.59 | 26.16,35.81 27.52,35.81 C12.2 | 26.16,35.81 U1.P$17 | v26.16,37.34 26.16,35.81 | v17.02,40.64 R4.2 | C15.2 1.56,36.79 v2.03,36.32 1.78,36.07 U1.P$68
  other vias: 3.81,16.26 26.16,39.37 22.35,13.59
  pour Power: 0.25,50.55 21.59,50.55 21.59,40.39 30.23,40.39 30.48,12.4 0.25,12.4
  pour Top: 3.05,16.76 3.05,13.97 3.56,13.46 4.57,13.46 4.57,16.51 4.06,17.02 3.3,17.02
  pour Top: 25.65,40.13 25.4,39.88 25.4,36.83 25.65,36.58 26.67,36.58 26.92,36.83 26.92,39.88 26.67,40.13
VDD
  Top 0.381: S2.3 15.49,33.53 16.13,32.89 S1.3 | Q3.2 15.82,30.05 arc-90 S1.3 | C4.2 16.13,30.29 S1.3
  Top 0.406: C2.1 17.27,17.02 | 19.56,16.76 C1.1 | C5.1 14.99,17.02 | C6.1 12.7,17.02
  Top 0.508: D2.1 19.81,17.15 C1.1 | Q1.2 24.82,18.36 24.13,19.05 24.13,22.1 | 24.13,22.1 R10.2 | 20.32,22.1 18.8,22.1 18.29,21.59 18.29,20.83 | 20.32,22.1 24.13,22.1 | 20.32,22.1 20.32,24.98 R3.2 20.99,25.31 21.34,25.65 21.34,27.94 20.83,28.45 20.32,28.45 18.8,29.97 16.51,29.97 S1.3
  Top 1.016: 15.75,19.3 15.49,19.05 | C9.1 C6.1 C5.1 15.11,16.89 15.24,16.76 19.56,16.76 | 10.41,17.02 10.41,19.05 | 12.7,17.02 12.7,19.05 | 14.99,17.02 14.99,18.8 | 17.27,17.02 17.27,19.05
  pour Top: 18.54,18.54 9.65,18.54 9.65,20.83 12.7,20.83 12.7,21.08 18.54,21.08
VOUT
  Top 0.381: U2.5 8.89,21.34 8.64,21.59 6.49,21.59 C19.1 | 5.35,15.75 5.35,19.15 R6.2
  Top 0.508: C14.1 5.35,15.75 L1.1
  pour Top: 6.6,18.8 3.56,18.8 3.56,22.35 6.6,22.35
VREG_EN  (via drill 0.3)
  Top 0.254: U2.3 7.94,24.06 v7.87,24.13
  Top 0.381: R2.2 13.17,26.92 v14.48,26.92 Q3.1
  Bottom 0.381: v7.87,24.13 13.72,24.13 14.48,24.89 v14.48,26.92

### Text on the board
tPlace: Lohit, Apoorva | Rev: 1A | Gecko